# Altium schematic sheet Cameras.SchDoc: Camera
size A4; Organization: Use Organization_Name in ProjParam; Address1: EFI & DBR; Address2: STI-IMT-LSRO1; Address3: EPFL; Address4: CH-1015 LAUSANNE; DocumentNumber: 6; Revision: A; SheetNumber: 6; SheetTotal: 2; ApprovedBy: Init ApprovedBy in DocParam; CheckedBy: Init CheckedBy in DocParam; Author: Init Author in DocParam; CompanyName: Init CompanyName in DocParam; DrawnBy: Init DrawBy in DocParam; Engineer: Init Engineer in DocParam; DocumentName: Init DocumentName in DocParam; ProjectName: Init ProjectName in DocParam
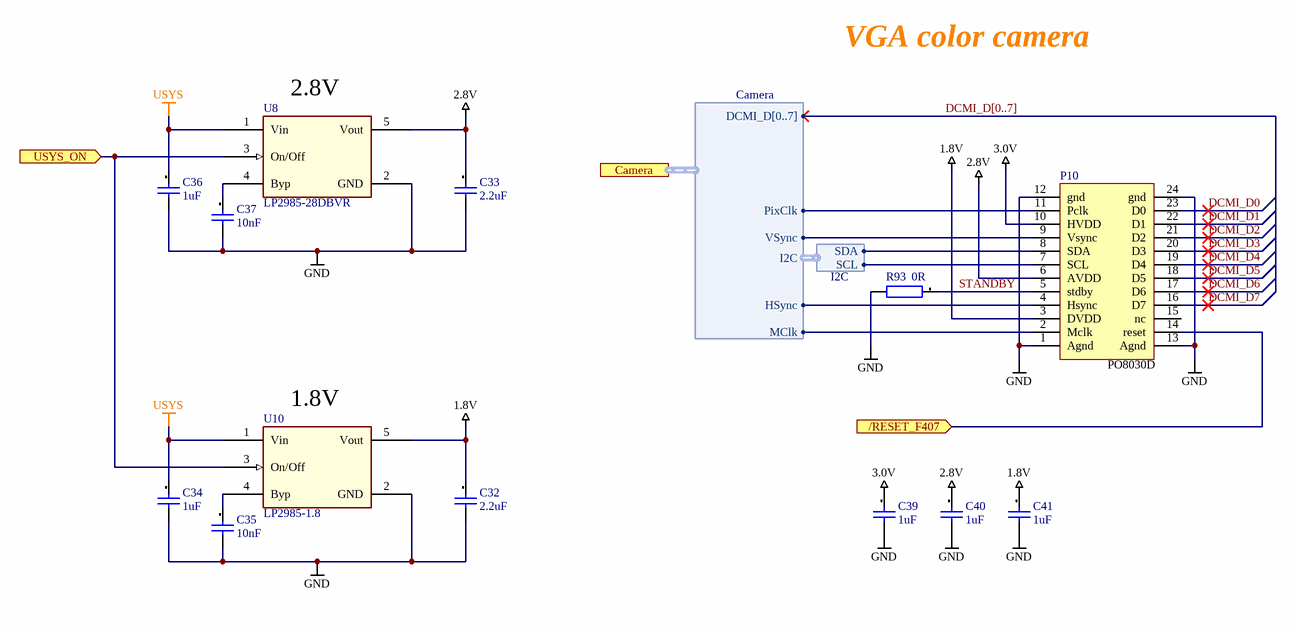
[diagram p0: Cameras.SchDoc]

## Parts
C32  2.2uF  [ROB_0603]
C33  2.2uF  [ROB_0603]
C34  1uF  [ROB_0603]
C35  10nF  [ROB_0603]
C36  1uF  [ROB_0603]
C37  10nF  [ROB_0603]
C39  1uF  [ROB_0603]
C40  1uF  [ROB_0603]
C41  1uF  [ROB_0603]
P10  24-5805-024-000-829  [Connector 24-5805-024-000-829]  (value not drawn)
R93  0R  [ROB_0603]
U8  value LP2985-28DBVR  [SOT95P285X100-5L]  (hidden comment: LDO 2V8)
U10  value LP2985-1.8  [SOT95P285X100-5L]  (hidden comment: LDO 1V8)

## Ports
/RESET_F407 (in), Camera (harness Camera), USYS_ON (in)

## Harnesses
Camera: DCMI_D[0..7], HSync, VSync, MClk, PixClk, I2C
I2C: SDA, SCL

## Nets
1.8V: C32.1 C41.1 P10.3(DVDD) U10.5(Vout)
2.8V: C33.1 C40.1 P10.6(AVDD) U8.5(Vout)
3.0V: C39.1 P10.10(HVDD)
GND: C32.2 C33.2 C34.2 C35.2 C36.2 C37.2 C39.2 C40.2 C41.2 P10.1(Agnd) P10.12(gnd) P10.13(Agnd) P10.24(gnd) R93.2 U8.2(GND) U10.2(GND)
USYS: C34.1 C36.1 U8.1(Vin) U10.1(Vin)
/RESET_F407: P10.14(reset) ; port /RESET_F407
DCMI_D0: P10.23(D0)
DCMI_D1: P10.22(D1)
DCMI_D2: P10.21(D2)
DCMI_D3: P10.20(D3)
DCMI_D4: P10.19(D4)
DCMI_D5: P10.18(D5)
DCMI_D6: P10.17(D6)
DCMI_D7: P10.16(D7)
STANDBY: P10.5(stdby) R93.1
USYS_ON: U8.3(On/Off) U10.3(On/Off) ; port USYS_ON
NetC35_1: C35.1 U10.4(Byp)
NetC37_1: C37.1 U8.4(Byp)
NetP10_2: P10.2(Mclk) ; port Camera.MClk
NetP10_4: P10.4(Hsync) ; port Camera.HSync
NetP10_7: P10.7(SCL) ; harness I2C.SCL
NetP10_8: P10.8(SDA) ; harness I2C.SDA
NetP10_9: P10.9(Vsync) ; port Camera.VSync
NetP10_11: P10.11(Pclk) ; port Camera.PixClk

Not connected (* = marked no-connect by the designer): P10 15(nc)

## Buses and harness runs
bus DCMI_D[0..7]

## Notes on the sheet
- VGA color camera
- (near U8) 2.8V
- (near U10) 1.8V
- (near P10) PO8030D
- Date:
- Project
- Part
- Revision:
- File :
- Page
- de

## Library data of the parts
C32 C33 = 2.2uF[[/\]]0805[[/\]]1: Capacitor; Manufacturer: Kemet; Manufacturer Nr: C0805C225K8PAC; Preference: 1; Tolerance +: +10; Tolerance -: -10; Dielectric: X5R; Voltage: 10; MaxTemperature: +85; MinTemperature: -55; Quant_2: 100; Quant_3: 1000; Quant_4: 2500; Currentie: CHF; Size: 0805; Footprint Acort: 0805_G; Supplier: Farnell; Supplier Nr: 9227822; ComponentLink2Description: Farnell link; ComponentLink2URL: http://ch.farnell.com/jsp/displayProduct.jsp?sku=9227822; Quant_1: 10; Price_1: 0,0488; Price_2: 0,456; Price_3: 0,425; Price_4: 0,393; ROHS: True; DateLastUpdate: 2007-12-03 / 14:22:49; Value: 2.2uF
C34 C36 C39-C41 = 1uF[[/\]]0603[[/\]]2: Capacitor; Manufacturer: Kemet; Manufacturer Nr: C0603C105K3PAC; Preference: 2; Tolerance +: +10; Tolerance -: -10; Dielectric: X7R; Voltage: 25; MaxTemperature: +125; MinTemperature: -55; Quant_1: 10; Quant_2: 100; Quant_3: 1000; Quant_4: 4000; Currentie: CHF; Size: 0603; Footprint Acort: 0603_G; Supplier: Farnell; Supplier Nr: 1288202; ComponentLink2Description: Farnell link; ComponentLink2URL: http://ch.farnell.com/jsp/displayProduct.jsp?sku=1288202; Price_1: 0,235; Price_2: 0,151; Price_3: 0,12; Price_4: 0,088; ROHS: True; DateLastUpdate: 2007-12-03 / 14:22:47; Value: 1uF
C35 C37 = 10nF[[/\]]0603[[/\]]1: Capacitor; Manufacturer: Multicomp; Manufacturer Nr: U0603R103KCT; Preference: 1; Tolerance +: +10; Tolerance -: -10; Dielectric: X7R; Voltage: 50; MaxTemperature: +125; MinTemperature: -55; Quant_1: 10; Quant_2: 100; Quant_3: 1000; Currentie: CHF; Size: 0603; Footprint Acort: 0603_G; Supplier: Farnell; Supplier Nr: 9406182; ComponentLink2Description: Farnell link; ComponentLink2URL: http://ch.farnell.com/jsp/displayProduct.jsp?sku=9406182; Price_1: 0,062; Price_2: 0,041; Price_3: 0,021; ROHS: True; DateLastUpdate: 2007-12-03 / 14:22:34; Value: 10nF
P10 = 24-5805-024-000-829: RCPT 24 pins camera 24-5805-024-000-829; value: 24-5805-024-000-829
R93 = 10K[[/\]]0603[[/\]]2: Resistor; Manufacturer: Multicomp; Manufacturer Nr: MC 0.063W 0603 1% 10K; Tolerance: +/-1; Preference: 2; Power: 0.063; Voltage: 50; Current: 1; ppm/K: +/-100; Quant_2: 250; Quant_3: 1000; Quant_4: 5000; Quant_5: 15000; Currentie: CHF; Value: 0R; Size: 0603; Footprint Acort: 0603; ComponentLink1Description: OnLine datasheet; Supplier: Farnell; Supplier Nr: 9330399; ComponentLink2Description: Farnell link; ComponentLink2URL: http://ch.farnell.com/jsp/displayProduct.jsp?sku=9330399; ROHS: True; Quant_1: 50; Price_1: 0,062; Price_2: 0,049; Price_3: 0,038; Price_4: 0,027; Price_5: 0,021; DateLastUpdate: 2007-11-29 / 09:14:40
U8 = LP2985-28DBVR: IC REG LDO 2.8V 0.15A SOT23-5; Manufacturer: Texas Instruments; Regulator Topology: Positive Fixed; Current - Output: 150mA; Voltage - Dropout (Typical): 0.28V @ 150mA; Voltage - Input: Up to 16V; Supplier 1: Digi-Key; RoHS: RoHS Compliant; Category: Integrated Circuits (ICs); Stock 1: 4483; Pricing 1: 1=0.58, 10=0.51, 100=0.3909, 500=0.309, 1000=0.2472 (USD); Packaging: Cut Tape (CT); Part Status: Active; Voltage - Output: 2.8V; Current - Limit (Min): -; Operating Temperature: -40°C ~ 125°C; Mounting Type: Surface Mount; Package / Case: SC-74A, SOT-753; Supplier Device Package: SOT-23-5; ComponentLink1URL: http://www.ti.com/lit/ds/symlink/lp2985-18.pdf; ComponentLink1Description: http://www.ti.com/lit/ds/symlink/lp2985-18.pdf; Supplier Part Number 1: 296-18475-1-ND
U10 = LP2985-1.8[[/\]]2: LDO 1.8V, 150mA, SOT23-5; Manufacturer: National; Manufacturer Nr: LP2992AIM5-1.8/NOPB; Preference: 2; Quant_1: 1; Quant_2: 10; Quant_3: 100; Quant_4: 250; Quant_5: 500; Currentie: CHF; Size: SOT-23; Footprint Acort: SOT23_5G; ComponentLink1Description: Datasheet; ComponentLink1URL: http://cache.national.com/ds/LP/LP2985LV.pdf; Supplier: Farnell; Supplier Nr: 1469131; ComponentLink2Description: Farnell link; ComponentLink2URL: http://fr.farnell.com/jsp/displayProduct.jsp?sku=1469131; Price_1: 1; Price_2: 0,7; Price_3: 0,59; Price_4: 0,51; Price_5: 0,48; ROHS: True; DateLastUpdate: 2007-12-03 / 16:58:10